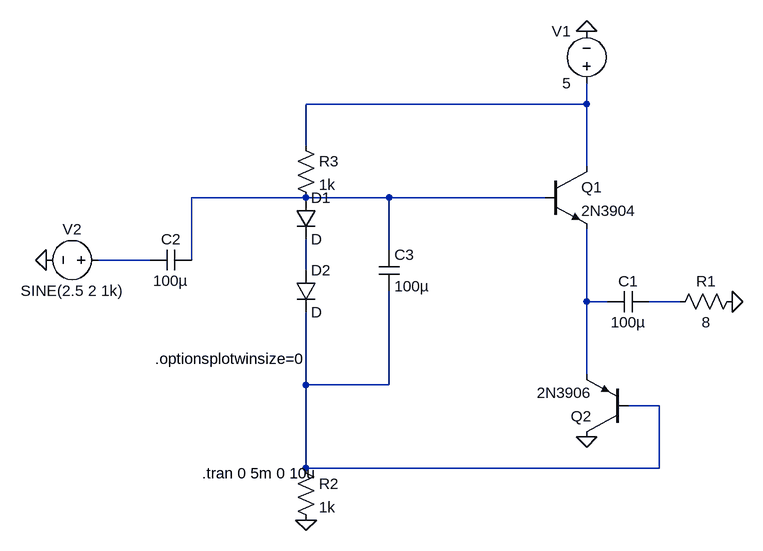
[diagram p0: schematic Project2PushPullAB.asc]
Project2PushPullAB.asc, the LTspice schematic file:
Version 4.1
SHEET 1 880 680
WIRE 272 -64 272 -96
WIRE 272 -64 -160 -64
WIRE -160 0 -160 -64
WIRE 272 32 272 -64
WIRE -160 80 -336 80
WIRE -32 80 -160 80
WIRE 208 80 -32 80
WIRE -32 160 -32 80
WIRE -400 176 -480 176
WIRE -336 176 -336 80
WIRE -160 192 -160 144
WIRE 272 240 272 128
WIRE 304 240 272 240
WIRE 416 240 368 240
WIRE 272 352 272 240
WIRE -160 368 -160 256
WIRE -32 368 -32 224
WIRE -32 368 -160 368
WIRE 384 400 336 400
WIRE -160 496 -160 368
WIRE 384 496 384 400
WIRE 384 496 -160 496
FLAG 496 240 0
FLAG 272 448 0
FLAG 272 -176 0
FLAG -160 576 0
FLAG -560 176 0
SYMBOL npn 208 32 R0
SYMATTR InstName Q1
SYMATTR Value 2N3904
SYMBOL res 512 224 R90
WINDOW 0 0 56 VBottom 2
WINDOW 3 32 56 VTop 2
SYMATTR InstName R1
SYMATTR Value 8
SYMBOL pnp 336 448 R180
SYMATTR InstName Q2
SYMATTR Value 2N3906
SYMBOL voltage 272 -80 R180
WINDOW 0 24 96 Left 2
WINDOW 3 24 16 Left 2
WINDOW 123 0 0 Left 0
WINDOW 39 0 0 Left 0
SYMATTR InstName V1
SYMATTR Value 5
SYMBOL cap 304 256 R270
WINDOW 0 32 32 VTop 2
WINDOW 3 0 32 VBottom 2
SYMATTR InstName C1
SYMATTR Value 100µ
SYMBOL res -176 -16 R0
SYMATTR InstName R3
SYMATTR Value 1k
SYMBOL diode -176 80 R0
SYMATTR InstName D1
SYMBOL diode -176 192 R0
SYMATTR InstName D2
SYMBOL res -176 480 R0
SYMATTR InstName R2
SYMATTR Value 1k
SYMBOL voltage -464 176 R90
WINDOW 0 -32 56 VBottom 2
WINDOW 3 32 56 VTop 2
WINDOW 123 0 0 Left 0
WINDOW 39 0 0 Left 0
SYMATTR InstName V2
SYMATTR Value SINE(2.5 2 1k)
SYMBOL cap -336 160 R90
WINDOW 0 0 32 VBottom 2
WINDOW 3 32 32 VTop 2
SYMATTR InstName C2
SYMATTR Value 100µ
SYMBOL cap -48 160 R0
SYMATTR InstName C3
SYMATTR Value 100µ
TEXT -320 504 Left 2 !.tran 0 5m 0 10u
TEXT -392 328 Left 2 !.optionsplotwinsize=0

The netlist it stands for:
* Project2PushPullAB.asc
Q1 N001 N002 N005 0 2N3904
R1 0 N006 8
Q2 0 N007 N005 0 2N3906
V1 N001 0 5
C1 N005 N006 100µ
R3 N001 N002 1k
D1 N002 N004 D
D2 N004 N007 D
R2 N007 0 1k
V2 N003 0 SINE(2.5 2 1k)
C2 N002 N003 100µ
C3 N002 N007 100µ
.model D D
.lib standard.dio
.model NPN NPN
.model PNP PNP
.lib standard.bjt
.tran 0 5m 0 10u
.optionsplotwinsize=0
.backanno
.end